# Altium schematic sheet AL2 Signal Isolation.SchDoc: AL2 Signal Isolation
size 292 x 193 mm; SheetNumber: 8; SheetTotal: 12
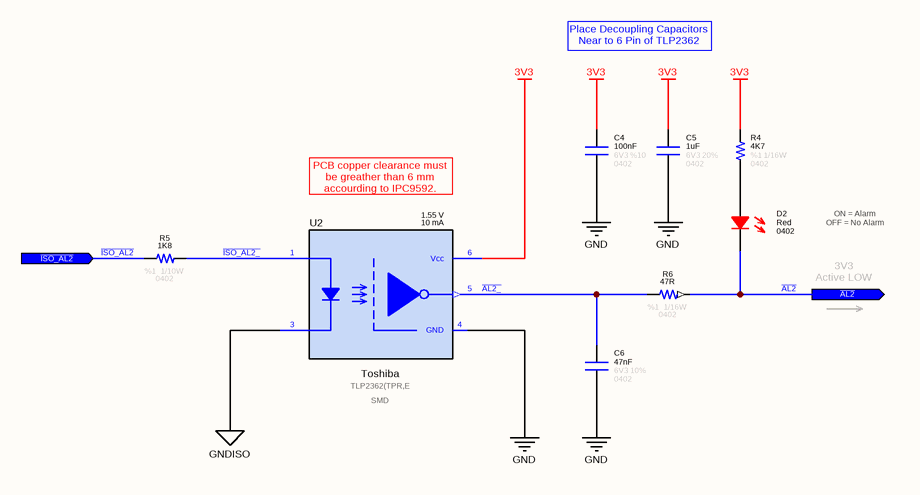
[diagram p0: AL2 Signal Isolation.SchDoc]

## Parts
C4  value 100nF  Tolerance: %10  Voltage: 6V3  Case: 0402  [CAPACITOR_0402]  (hidden comment: Capacitor - 100nF [0402] (Ceramic))
C5  value 1uF  Tolerance: 20%  Case: 0402  Voltage: 6V3  [CAPACITOR_0402]  (hidden comment: Capacitor - 1uF [0402] (MLCC))
C6  value 47nF  Tolerance: 10%  Case: 0402  Voltage: 6V3  [CAPACITOR_0402]  (hidden comment: Capacitor - 47nF [0402] (MLCC))
D2  Case: 0402  Color: Red  [LED_0402]  (hidden comment: SMD LED (Red))
R4  value 4K7  Tolerance: %1  Case: 0402  Power: 1/16W  [RESISTOR_0402]  (hidden comment: 4K7 - 0402 - %1 - 1/16W)
R5  value 1K8  Tolerance: %1  Case: 0402  Power: 1/10W  [RESISTOR_0402]  (hidden comment: 1K8 - 0402 - %1 - 1/16W)
R6  value 47R  Case: 0402  Tolerance: %1  Power: 1/16W  [RESISTOR_0402]  (hidden comment: 47R - 0402 - %1 - 1/16W)
U2  If - Forward Current: 10 mA  Vf - Forward Voltage: 1.55 V  Manufacturer Name: Toshiba  Case: SMD  [TLP2362]  (hidden comment: TLP2362(TPR,E)

## Ports
~{AL2} (out), ~{ISO_AL2} (in)

## Nets
3V3: C4.2 C5.2 R4.2 U2.6(Vcc)
GND: C4.1 C5.1 C6.1 U2.4(GND)
GNDISO: U2.3(Cathode)
~{AL2}: D2.1 R6.1 ; port ~{AL2}
~{AL2_}: C6.2 R6.2 U2.5(Output)
~{ISO_AL2}: R5.2 ; port ~{ISO_AL2}
~{ISO_AL2_}: R5.1 U2.1(Anode)
NetD2_2: D2.2 R4.1

## Notes on the sheet
- Place Decoupling Capacitors Near to 6 Pin of TLP2362
- PCB copper clearance must be greather than 6 mm accourding to IPC9592.
- ON = Alarm
  OFF = No Alarm
- 3V3
  Active LOW
- © 2021 All rights reserved.
  This document may not, in whole or in part, be copied, photocopied, reproduced, translated or converted to any electronic or machine readable from without prior written permission of Mehmet Günce Akkoyun.
  Engineer contact : akkoyun@me.com
- Property of
- Engineer :
- Date :
- Size :
- A4
- Time :
- Project :
- Page :
- /
- Customer :
- Product ID :
- Module ID :
- Version :
- File :
- Revision :

## Library data of the parts
C4 = Capacitor - 100nF [0402-6V3]: Capacitor - 100nF [0402-6V3] (Ceramic); Manufacturer Name: AVX; Manufacturer Part Number: 04026D104KAT4A; ComponentLink1Description: Mouser; ComponentLink1URL: https://www.mouser.com.tr/ProductDetail/AVX/04026D104KAT4A?qs=sGAEpiMZZMs0AnBnWHyRQPg4iYkCw7IMED%2F4kpqgf7w%3D; ComponentLink2Description: DataSheet; ComponentLink2URL: https://www.mouser.com.tr/datasheet/2/40/cx5r-776519.pdf
C5 = Capacitor - 1uF [0402-6V3]: Capacitor (MLCC) - 1uF / 6V3 / 0402; Manufacturer Part Number: GRM153R60J105ME95D; Manufacturer Name: Murata Electronics; ComponentLink1Description: DataSheet; ComponentLink1URL: https://www.mouser.com.tr/datasheet/2/281/murata_03052018_GRM_Series_1-1310166.pdf; ComponentLink2Description: Mouser; ComponentLink2URL: https://www.mouser.com.tr/ProductDetail/Murata-Electronics/GRM153R60J105ME95D?qs=eeBpzGFlv%252B8jOnvCVAGQrQ%3D%3D; Subcategory: Capacitors
C6 = Capacitor - 47nF [0402-6V3]: Capacitor (MLCC) - 47nF / 6V3 / 0402; Manufacturer Name: KYOCERA AVX; Manufacturer Part Number: 04026D473KAT2A; Subcategory: Capacitors
D2 = Diode - LED (0402-Red): Standard LEDs - SMD MINI-MOLD ULTRA COMPACT RED; Manufacturer Name: ROHM Semiconductor; Manufacturer Part Number: SML-P12VTT86R; ROHS: Yes; ComponentLink1Description: DataSheet; ComponentLink1URL: https://www.mouser.com.tr/datasheet/2/348/sml-p1-e-1139198.pdf; ComponentLink2Description: Mouser; ComponentLink2URL: https://www.mouser.com.tr/ProductDetail/ROHM-Semiconductor/SML-P12U2TT86R?qs=sGAEpiMZZMseGfSY3csMkRIBDsfU3UCXJTULB5gem9Ta%252Bp%252BvZ709fg%3D%3D
R4 = Resistor - 4K7 [0402]: Thick Film Resistors - SMD 1/16 W 4.7 KOhm 1%; Manufacturer Name: Vishay; Manufacturer Part Number: CRCW04024K70FKED; ComponentLink1Description: DataSheet; ComponentLink1URL: https://www.mouser.com.tr/datasheet/2/427/dcrcwe3-1762152.pdf; ComponentLink2Description: Mouser; ComponentLink2URL: https://www.mouser.com.tr/ProductDetail/Vishay-Dale/CRCW04024K70FKED?qs=sGAEpiMZZMu61qfTUdNhG7nHf%2F6MTUn3HadIdDQu24Q%3D
R5 = Resistor - 1K8 [0402]: Thick Film Resistors - SMD 1/16 W 1.8 KOhm 1%; Manufacturer Name: Vishay; Manufacturer Part Number: CRCW04021K80FKED; ComponentLink1Description: DataSheet; ComponentLink1URL: https://www.mouser.com.tr/datasheet/2/427/dcrcwe3-1762152.pdf; ComponentLink2Description: Mouser; ComponentLink2URL: https://www.mouser.com.tr/ProductDetail/Vishay-Dale/CRCW04024K70FKED?qs=sGAEpiMZZMu61qfTUdNhG7nHf%2F6MTUn3HadIdDQu24Q%3D
R6 = Resistor - 47R [0402]: Thick Film Resistors - SMD 1/16 W 47 Ohm 1%; Manufacturer Name: Vishay; Manufacturer Part Number: CRCW040247R0FKED; ComponentLink1Description: DataSheet; ComponentLink1URL: https://www.mouser.com.tr/datasheet/2/427/dcrcwe3-1762152.pdf; ComponentLink2Description: Mouser; ComponentLink2URL: https://www.mouser.com.tr/ProductDetail/Vishay-Dale/CRCW0402330RFKED?qs=sGAEpiMZZMu61qfTUdNhG2DpbjADlD3GGS6SwBlLi5Q%3D
U2 = IC - TLP2362: High Speed Optocouplers 3750 Vrms 10MBd 4mA 2.7 to 5.5V LED; Manufacturer Part Number: TLP2362(TPR,E